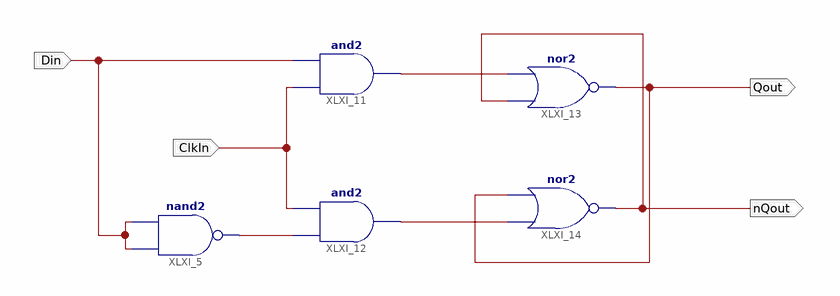
[diagram p0: schematic sheet 1]
// Xilinx ISE schematic NOR_DFF.sch (spartan3e) as structural Verilog: 5 symbols, 4 ports
module NOR_DFF (
  input  Din,
  input  ClkIn,
  output Qout,
  output nQout
);

  wire XLXN_7, XLXN_8, XLXN_9;

  nand XLXI_5 (XLXN_7, Din, Din);
  and XLXI_11 (XLXN_9, ClkIn, Din);
  and XLXI_12 (XLXN_8, XLXN_7, ClkIn);
  nor XLXI_13 (Qout, nQout, XLXN_9);
  nor XLXI_14 (nQout, XLXN_8, Qout);
endmodule
